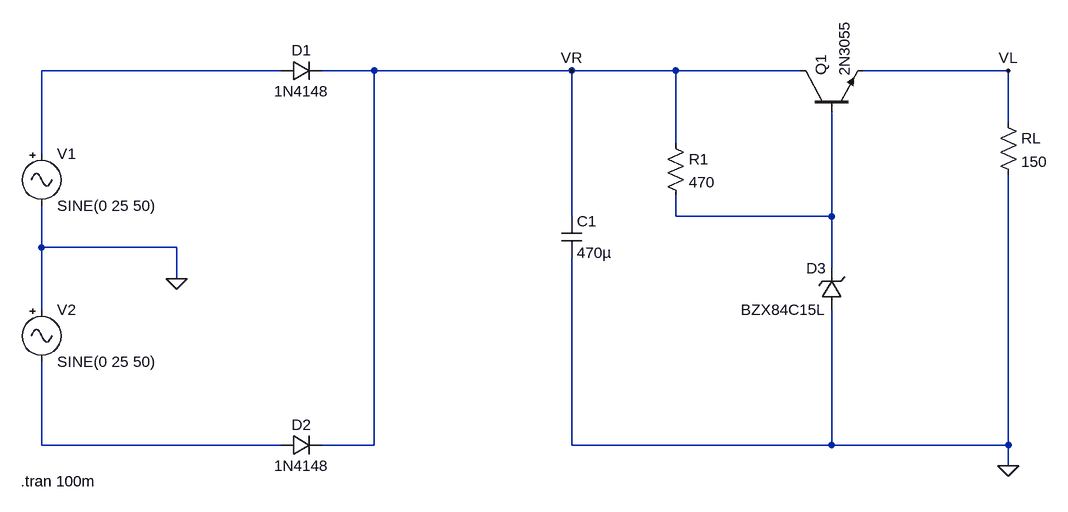
[diagram p0: schematic 15v_dc_guc_kaynağı_itü.asc]
15v_dc_guc_kaynağı_itü.asc, the LTspice schematic file:
Version 4
SHEET 1 1572 680
WIRE 384 0 16 0
WIRE 528 0 448 0
WIRE 832 0 528 0
WIRE 992 0 832 0
WIRE 1184 0 992 0
WIRE 1504 0 1280 0
WIRE 1504 80 1504 0
WIRE 992 112 992 0
WIRE 16 128 16 0
WIRE 832 224 832 0
WIRE 992 224 992 192
WIRE 1232 224 1232 64
WIRE 1232 224 992 224
WIRE 16 272 16 208
WIRE 224 272 16 272
WIRE 1232 304 1232 224
WIRE 224 320 224 272
WIRE 16 368 16 272
WIRE 16 576 16 448
WIRE 384 576 16 576
WIRE 528 576 528 0
WIRE 528 576 448 576
WIRE 832 576 832 288
WIRE 1232 576 1232 368
WIRE 1232 576 832 576
WIRE 1504 576 1504 160
WIRE 1504 576 1232 576
WIRE 1504 608 1504 576
FLAG 224 320 0
FLAG 1504 608 0
FLAG 832 0 VR
FLAG 1504 0 VL
SYMBOL Misc\\signal 16 112 R0
WINDOW 123 0 0 Left 0
WINDOW 39 0 0 Left 0
SYMATTR InstName V1
SYMATTR Value SINE(0 25 50)
SYMBOL Misc\\signal 16 352 R0
WINDOW 123 0 0 Left 0
WINDOW 39 0 0 Left 0
SYMATTR InstName V2
SYMATTR Value SINE(0 25 50)
SYMBOL diode 384 16 R270
WINDOW 0 32 32 VTop 2
WINDOW 3 0 32 VBottom 2
SYMATTR InstName D1
SYMATTR Value 1N4148
SYMBOL diode 384 592 R270
WINDOW 0 32 32 VTop 2
WINDOW 3 0 32 VBottom 2
SYMATTR InstName D2
SYMATTR Value 1N4148
SYMBOL cap 816 224 R0
SYMATTR InstName C1
SYMATTR Value 470µ
SYMBOL res 976 96 R0
SYMATTR InstName R1
SYMATTR Value 470
SYMBOL npn 1184 64 R270
SYMATTR InstName Q1
SYMATTR Value 2N3055
SYMBOL zener 1248 368 R180
WINDOW 0 24 64 Left 2
WINDOW 3 24 0 Left 2
SYMATTR InstName D3
SYMATTR Value BZX84C15L
SYMBOL res 1488 64 R0
SYMATTR InstName RL
SYMATTR Value 150
TEXT -16 632 Left 2 !.tran 100m

The netlist it stands for:
* 15v_dc_guc_kaynağı_itü.asc
V1 N001 0 SINE(0 25 50)
V2 0 N003 SINE(0 25 50)
D1 N001 VR 1N4148
D2 N003 VR 1N4148
C1 VR 0 470µ
R1 VR N002 470
Q1 VR N002 VL 0 2N3055
D3 0 N002 BZX84C15L
RL VL 0 150
.model D D
.lib standard.dio
.model NPN NPN
.model PNP PNP
.lib standard.bjt
.tran 100m
.backanno
.end